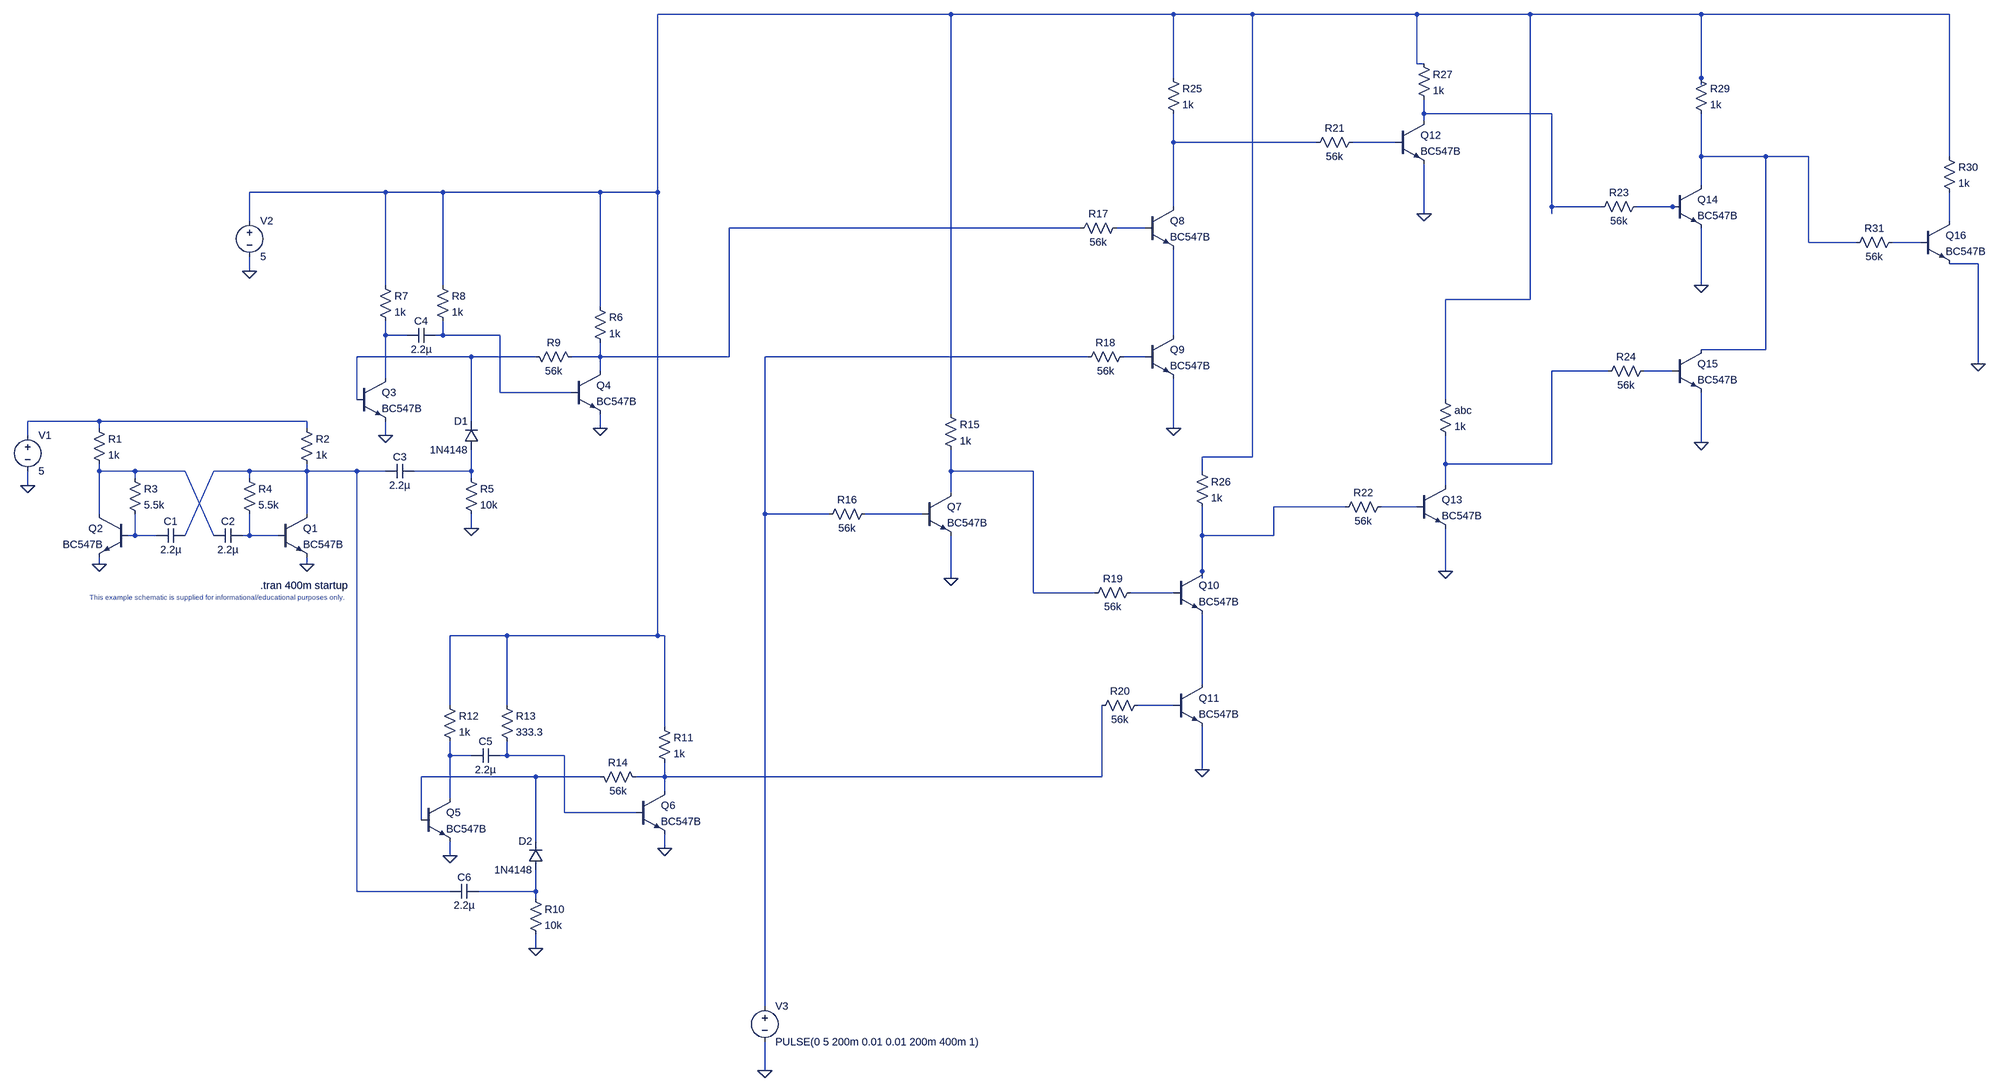
[diagram p0: schematic PWMgenerator_2_1_mux.asc]
PWMgenerator_2_1_mux.asc, the LTspice schematic file:
Version 4
SHEET 1 4788 1572
WIRE 2128 -1344 1472 -1344
WIRE 2816 -1344 2128 -1344
WIRE 2992 -1344 2816 -1344
WIRE 3360 -1344 2992 -1344
WIRE 3680 -1344 3360 -1344
WIRE 4144 -1344 3680 -1344
WIRE 4704 -1344 4144 -1344
WIRE 3360 -800 3360 -1344
WIRE 3376 -800 3360 -800
WIRE 2816 -768 2816 -1344
WIRE 4144 -768 4144 -1344
WIRE 4144 -752 4144 -768
WIRE 3376 -688 3376 -720
WIRE 3728 -688 3376 -688
WIRE 3376 -672 3376 -688
WIRE 2816 -624 2816 -688
WIRE 3136 -624 2816 -624
WIRE 3312 -624 3216 -624
WIRE 4144 -592 4144 -688
WIRE 4288 -592 4144 -592
WIRE 4384 -592 4288 -592
WIRE 4704 -592 4704 -1344
WIRE 4144 -528 4144 -592
WIRE 864 -512 560 -512
WIRE 992 -512 864 -512
WIRE 1344 -512 992 -512
WIRE 1472 -512 1472 -1344
WIRE 1472 -512 1344 -512
WIRE 2816 -480 2816 -624
WIRE 3728 -480 3728 -688
WIRE 3920 -480 3728 -480
WIRE 4080 -480 4000 -480
WIRE 4096 -480 4080 -480
WIRE 3376 -464 3376 -576
WIRE 3728 -464 3728 -480
WIRE 560 -448 560 -512
WIRE 4704 -448 4704 -512
WIRE 2608 -432 1632 -432
WIRE 2752 -432 2688 -432
WIRE 4384 -400 4384 -592
WIRE 4496 -400 4384 -400
WIRE 4640 -400 4576 -400
WIRE 4768 -352 4704 -352
WIRE 560 -336 560 -368
WIRE 864 -304 864 -512
WIRE 992 -304 992 -512
WIRE 4144 -304 4144 -432
WIRE 3680 -272 3680 -1344
WIRE 3680 -272 3424 -272
WIRE 1344 -256 1344 -512
WIRE 864 -192 864 -224
WIRE 912 -192 864 -192
WIRE 992 -192 992 -224
WIRE 992 -192 976 -192
WIRE 1120 -192 992 -192
WIRE 2816 -192 2816 -384
WIRE 4288 -160 4288 -592
WIRE 4288 -160 4144 -160
WIRE 1056 -144 800 -144
WIRE 1200 -144 1056 -144
WIRE 1344 -144 1344 -176
WIRE 1344 -144 1280 -144
WIRE 1632 -144 1632 -432
WIRE 1632 -144 1344 -144
WIRE 2624 -144 1712 -144
WIRE 2752 -144 2704 -144
WIRE 4768 -128 4768 -352
WIRE 1344 -112 1344 -144
WIRE 3936 -112 3728 -112
WIRE 4080 -112 4016 -112
WIRE 864 -96 864 -192
WIRE 1120 -64 1120 -192
WIRE 1280 -64 1120 -64
WIRE 800 -48 800 -144
WIRE 3424 -48 3424 -272
WIRE 2128 -16 2128 -1344
WIRE 224 0 64 0
WIRE 688 0 224 0
WIRE 1056 0 1056 -144
WIRE 224 16 224 0
WIRE 688 16 688 0
WIRE 1344 16 1344 -16
WIRE 2816 16 2816 -96
WIRE 64 32 64 0
WIRE 864 32 864 0
WIRE 4144 48 4144 -64
WIRE 2992 80 2992 -1344
WIRE 2992 80 2880 80
WIRE 3424 96 3424 32
WIRE 3728 96 3728 -112
WIRE 3728 96 3424 96
WIRE 224 112 224 96
WIRE 304 112 224 112
WIRE 416 112 304 112
WIRE 560 112 480 112
WIRE 688 112 688 96
WIRE 688 112 560 112
WIRE 800 112 688 112
WIRE 864 112 800 112
WIRE 1056 112 1056 64
WIRE 1056 112 928 112
WIRE 2128 112 2128 64
WIRE 2432 112 2128 112
WIRE 2880 112 2880 80
WIRE 304 128 304 112
WIRE 560 128 560 112
WIRE 1056 128 1056 112
WIRE 64 144 64 112
WIRE 3424 144 3424 96
WIRE 2128 160 2128 112
WIRE 3200 192 3040 192
WIRE 3360 192 3280 192
WIRE 224 208 224 112
WIRE 688 208 688 112
WIRE 1712 208 1712 -144
WIRE 1856 208 1712 208
WIRE 2064 208 1936 208
WIRE 1056 240 1056 208
WIRE 304 256 304 208
WIRE 304 256 288 256
WIRE 352 256 304 256
WIRE 416 256 480 112
WIRE 480 256 416 112
WIRE 560 256 560 208
WIRE 560 256 544 256
WIRE 624 256 560 256
WIRE 2880 256 2880 192
WIRE 3040 256 3040 192
WIRE 3040 256 2880 256
WIRE 224 320 224 304
WIRE 688 320 688 304
WIRE 2880 336 2880 256
WIRE 3424 336 3424 240
WIRE 2128 352 2128 256
WIRE 2880 352 2880 336
WIRE 2432 384 2432 112
WIRE 2640 384 2432 384
WIRE 2816 384 2720 384
WIRE 1136 480 1008 480
WIRE 1472 480 1472 -512
WIRE 1472 480 1136 480
WIRE 1488 480 1472 480
WIRE 2880 640 2880 432
WIRE 1008 688 1008 480
WIRE 1136 688 1136 480
WIRE 2816 688 2736 688
WIRE 1488 736 1488 480
WIRE 1008 800 1008 768
WIRE 1056 800 1008 800
WIRE 1136 800 1136 768
WIRE 1136 800 1120 800
WIRE 1264 800 1136 800
WIRE 2880 832 2880 736
WIRE 1200 848 944 848
WIRE 1344 848 1200 848
WIRE 1488 848 1488 816
WIRE 1488 848 1424 848
WIRE 2656 848 2656 688
WIRE 2656 848 1488 848
WIRE 1488 880 1488 848
WIRE 1008 896 1008 800
WIRE 1264 928 1264 800
WIRE 1424 928 1264 928
WIRE 944 944 944 848
WIRE 1200 992 1200 848
WIRE 1488 1008 1488 976
WIRE 1008 1024 1008 992
WIRE 800 1104 800 112
WIRE 1008 1104 800 1104
WIRE 1200 1104 1200 1056
WIRE 1200 1104 1072 1104
WIRE 1200 1120 1200 1104
WIRE 1200 1232 1200 1200
WIRE 1712 1408 1712 208
WIRE 1712 1552 1712 1488
FLAG 688 320 0
FLAG 224 320 0
FLAG 64 144 0
FLAG 560 -336 0
FLAG 864 32 0
FLAG 1344 16 0
FLAG 1056 240 0
FLAG 1008 1024 0
FLAG 1488 1008 0
FLAG 1200 1232 0
FLAG 2128 352 0
FLAG 2816 16 0
FLAG 2880 832 0
FLAG 3424 336 0
FLAG 3376 -464 0
FLAG 4144 48 0
FLAG 1712 1552 0
FLAG 4768 -128 0
FLAG 4144 -304 0
SYMBOL RES 208 0 R0
SYMATTR InstName R1
SYMATTR Value 1k
SYMBOL res 672 0 R0
SYMATTR InstName R2
SYMATTR Value 1k
SYMBOL res 288 112 R0
SYMATTR InstName R3
SYMATTR Value 5.5k
SYMBOL res 544 112 R0
SYMATTR InstName R4
SYMATTR Value 5.5k
SYMBOL cap 416 240 R90
WINDOW 0 0 32 VBottom 2
WINDOW 3 32 32 VTop 2
SYMATTR InstName C1
SYMATTR Value 2.2µ
SYMBOL cap 544 240 R90
WINDOW 0 0 32 VBottom 2
WINDOW 3 32 32 VTop 2
SYMATTR InstName C2
SYMATTR Value 2.2µ
SYMBOL VOLTAGE 64 16 R0
SYMATTR InstName V1
SYMATTR Value 5
SYMBOL NPN 624 208 R0
SYMATTR InstName Q1
SYMATTR Value BC547B
SYMBOL npn 288 208 M0
SYMATTR InstName Q2
SYMATTR Value BC547B
SYMBOL res 1040 112 R0
SYMATTR InstName R5
SYMATTR Value 10k
SYMBOL diode 1072 64 R180
WINDOW 0 24 64 Left 2
WINDOW 3 24 0 Left 2
SYMATTR InstName D1
SYMATTR Value 1N4148
SYMBOL npn 800 -96 R0
SYMATTR InstName Q3
SYMATTR Value BC547B
SYMBOL npn 1280 -112 R0
SYMATTR InstName Q4
SYMATTR Value BC547B
SYMBOL res 1328 -272 R0
SYMATTR InstName R6
SYMATTR Value 1k
SYMBOL res 848 -320 R0
SYMATTR InstName R7
SYMATTR Value 1k
SYMBOL res 976 -320 R0
SYMATTR InstName R8
SYMATTR Value 1k
SYMBOL cap 976 -208 R90
WINDOW 0 0 32 VBottom 2
WINDOW 3 32 32 VTop 2
SYMATTR InstName C4
SYMATTR Value 2.2µ
SYMBOL res 1184 -160 M90
WINDOW 0 0 56 VBottom 2
WINDOW 3 32 56 VTop 2
SYMATTR InstName R9
SYMATTR Value 56k
SYMBOL voltage 560 -464 R0
WINDOW 123 0 0 Left 0
WINDOW 39 0 0 Left 0
SYMATTR InstName V2
SYMATTR Value 5
SYMBOL cap 928 96 R90
WINDOW 0 0 32 VBottom 2
WINDOW 3 32 32 VTop 2
SYMATTR InstName C3
SYMATTR Value 2.2µ
SYMBOL res 1184 1104 R0
SYMATTR InstName R10
SYMATTR Value 10k
SYMBOL diode 1216 1056 R180
WINDOW 0 24 64 Left 2
WINDOW 3 24 0 Left 2
SYMATTR InstName D2
SYMATTR Value 1N4148
SYMBOL npn 944 896 R0
SYMATTR InstName Q5
SYMATTR Value BC547B
SYMBOL npn 1424 880 R0
SYMATTR InstName Q6
SYMATTR Value BC547B
SYMBOL res 1472 720 R0
SYMATTR InstName R11
SYMATTR Value 1k
SYMBOL res 992 672 R0
SYMATTR InstName R12
SYMATTR Value 1k
SYMBOL res 1120 672 R0
SYMATTR InstName R13
SYMATTR Value 333.3
SYMBOL cap 1120 784 R90
WINDOW 0 0 32 VBottom 2
WINDOW 3 32 32 VTop 2
SYMATTR InstName C5
SYMATTR Value 2.2µ
SYMBOL res 1328 832 M90
WINDOW 0 0 56 VBottom 2
WINDOW 3 32 56 VTop 2
SYMATTR InstName R14
SYMATTR Value 56k
SYMBOL cap 1072 1088 R90
WINDOW 0 0 32 VBottom 2
WINDOW 3 32 32 VTop 2
SYMATTR InstName C6
SYMATTR Value 2.2µ
SYMBOL res 2112 -32 R0
SYMATTR InstName R15
SYMATTR Value 1k
SYMBOL res 1952 192 R90
WINDOW 0 0 56 VBottom 2
WINDOW 3 32 56 VTop 2
SYMATTR InstName R16
SYMATTR Value 56k
SYMBOL res 2704 -448 R90
WINDOW 0 0 56 VBottom 2
WINDOW 3 32 56 VTop 2
SYMATTR InstName R17
SYMATTR Value 56k
SYMBOL res 2720 -160 R90
WINDOW 0 0 56 VBottom 2
WINDOW 3 32 56 VTop 2
SYMATTR InstName R18
SYMATTR Value 56k
SYMBOL res 2736 368 R90
WINDOW 0 0 56 VBottom 2
WINDOW 3 32 56 VTop 2
SYMATTR InstName R19
SYMATTR Value 56k
SYMBOL res 2752 672 R90
WINDOW 0 0 56 VBottom 2
WINDOW 3 32 56 VTop 2
SYMATTR InstName R20
SYMATTR Value 56k
SYMBOL res 3232 -640 R90
WINDOW 0 0 56 VBottom 2
WINDOW 3 32 56 VTop 2
SYMATTR InstName R21
SYMATTR Value 56k
SYMBOL res 3296 176 R90
WINDOW 0 0 56 VBottom 2
WINDOW 3 32 56 VTop 2
SYMATTR InstName R22
SYMATTR Value 56k
SYMBOL res 4016 -496 R90
WINDOW 0 0 56 VBottom 2
WINDOW 3 32 56 VTop 2
SYMATTR InstName R23
SYMATTR Value 56k
SYMBOL res 4032 -128 R90
WINDOW 0 0 56 VBottom 2
WINDOW 3 32 56 VTop 2
SYMATTR InstName R24
SYMATTR Value 56k
SYMBOL res 2800 -784 R0
SYMATTR InstName R25
SYMATTR Value 1k
SYMBOL res 2864 96 R0
SYMATTR InstName R26
SYMATTR Value 1k
SYMBOL res 3360 -816 R0
SYMATTR InstName R27
SYMATTR Value 1k
SYMBOL res 3408 -64 R0
SYMATTR InstName abc
SYMATTR Value 1k
SYMBOL res 4128 -784 R0
SYMATTR InstName R29
SYMATTR Value 1k
SYMBOL npn 2064 160 R0
SYMATTR InstName Q7
SYMATTR Value BC547B
SYMBOL npn 2752 -480 R0
SYMATTR InstName Q8
SYMATTR Value BC547B
SYMBOL npn 2752 -192 R0
SYMATTR InstName Q9
SYMATTR Value BC547B
SYMBOL npn 2816 336 R0
SYMATTR InstName Q10
SYMATTR Value BC547B
SYMBOL npn 2816 640 R0
SYMATTR InstName Q11
SYMATTR Value BC547B
SYMBOL npn 3312 -672 R0
SYMATTR InstName Q12
SYMATTR Value BC547B
SYMBOL npn 3360 144 R0
SYMATTR InstName Q13
SYMATTR Value BC547B
SYMBOL npn 4080 -528 R0
SYMATTR InstName Q14
SYMATTR Value BC547B
SYMBOL npn 4080 -160 R0
SYMATTR InstName Q15
SYMATTR Value BC547B
SYMBOL voltage 1712 1392 R0
WINDOW 123 0 0 Left 0
WINDOW 39 0 0 Left 0
SYMATTR InstName V3
SYMATTR Value PULSE(0 5 200m 0.01 0.01 200m 400m 1)
SYMBOL res 4688 -608 R0
SYMATTR InstName R30
SYMATTR Value 1k
SYMBOL res 4592 -416 R90
WINDOW 0 0 56 VBottom 2
WINDOW 3 32 56 VTop 2
SYMATTR InstName R31
SYMATTR Value 56k
SYMBOL npn 4640 -448 R0
SYMATTR InstName Q16
SYMATTR Value BC547B
TEXT 584 368 Left 2 !.tran 400m startup
TEXT 488 384 Top 1 ;This example schematic is supplied for informational/educational purposes only.

The netlist it stands for:
* PWMgenerator_2_1_mux.asc
R1 N019 N020 1k
R2 N019 N021 1k
R3 N020 N027 5.5k
R4 N021 N028 5.5k
C1 N021 N027 2.2µ
C2 N028 N020 2.2µ
V1 N019 0 5
Q1 N021 N028 0 0 BC547B
Q2 N020 N027 0 0 BC547B
R5 N022 0 10k
D1 N022 N014 1N4148
Q3 N011 N014 0 0 BC547B
Q4 N008 N012 0 0 BC547B
R6 N001 N008 1k
R7 N001 N011 1k
R8 N001 N012 1k
C4 N012 N011 2.2µ
R9 N014 N008 56k
V2 N001 0 5
C3 N022 N021 2.2µ
R10 N036 0 10k
D2 N036 N034 1N4148
Q5 N032 N034 0 0 BC547B
Q6 N035 N033 0 0 BC547B
R11 N001 N035 1k
R12 N001 N032 1k
R13 N001 N033 333.3
C5 N033 N032 2.2µ
R14 N034 N035 56k
C6 N036 N021 2.2µ
R15 N001 N023 1k
R16 N026 N015 56k
R17 N009 N008 56k
R18 N016 N015 56k
R19 N029 N023 56k
R20 N031 N035 56k
R21 N004 N003 56k
R22 N025 N024 56k
R23 N006 N002 56k
R24 N018 N017 56k
R25 N001 N003 1k
R26 N001 N024 1k
R27 N001 N002 1k
R§abc N001 N017 1k
R29 N001 N005 1k
Q7 N023 N026 0 0 BC547B
Q8 N003 N009 N013 0 BC547B
Q9 N013 N016 0 0 BC547B
Q10 N024 N029 N030 0 BC547B
Q11 N030 N031 0 0 BC547B
Q12 N002 N004 0 0 BC547B
Q13 N017 N025 0 0 BC547B
Q14 N005 N006 0 0 BC547B
Q15 N005 N018 0 0 BC547B
V3 N015 0 PULSE(0 5 200m 0.01 0.01 200m 400m 1)
R30 N001 N007 1k
R31 N010 N005 56k
Q16 N007 N010 0 0 BC547B
.model D D
.lib standard.dio
.model NPN NPN
.model PNP PNP
.lib standard.bjt
.tran 400m startup
* This example schematic is supplied for informational/educational purposes only.
.backanno
.end